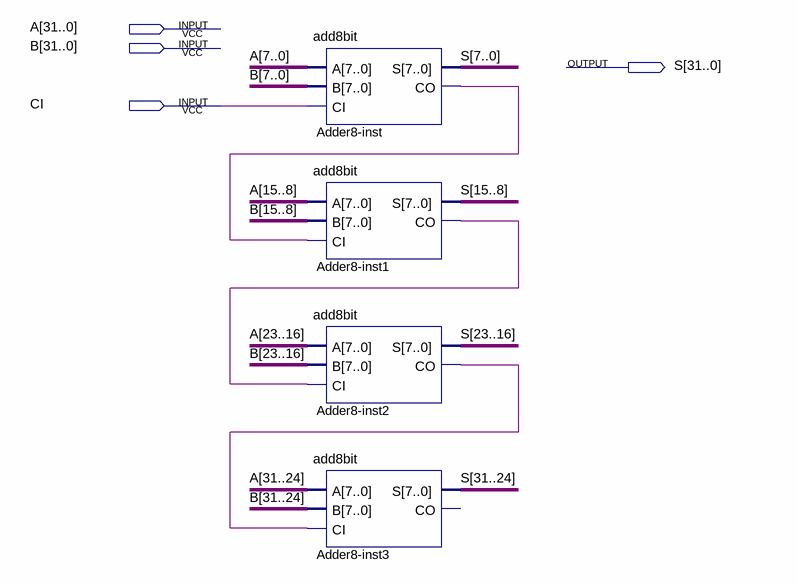
[diagram p0: schematic sheet]
// Quartus schematic add32bitci.bdf as structural Verilog: 4 symbols, 4 pins
module add32bitci (
  input  [31:0] A,
  input  [31:0] B,
  input  CI,
  output [31:0] S
);

  wire Adder8_inst1_co, Adder8_inst2_co, Adder8_inst_co;

  add8bit \Adder8-inst  (.A(A[7:0]), .B(B[7:0]), .CI(CI), .S(S[7:0]), .CO(Adder8_inst_co));
  add8bit \Adder8-inst1  (.A(A[15:8]), .B(B[15:8]), .CI(Adder8_inst_co), .S(S[15:8]), .CO(Adder8_inst1_co));
  add8bit \Adder8-inst2  (.A(A[23:16]), .B(B[23:16]), .CI(Adder8_inst1_co), .S(S[23:16]), .CO(Adder8_inst2_co));
  add8bit \Adder8-inst3  (.A(A[31:24]), .B(B[31:24]), .CI(Adder8_inst2_co), .S(S[31:24]));  // open: CO
endmodule
